# Altium project PCB_Project1.PrjPCB
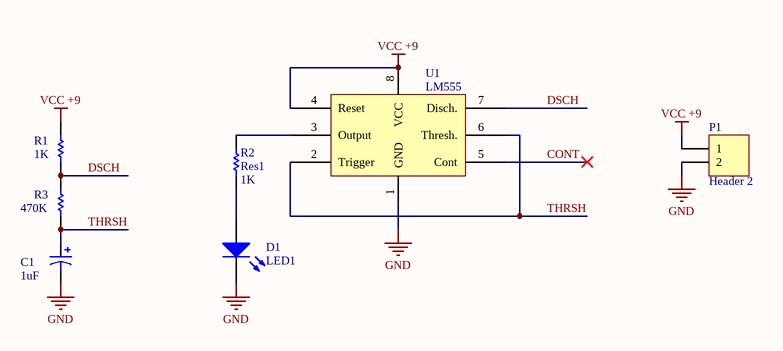
[diagram p0: Sheet1.SchDoc]
1 sheet, 7 parts. Net scope: global (net labels, ports and power ports of the same name join across sheets).

## Sheet Sheet1.SchDoc
size A4

### Parts
C1  value 1uF  [RB7.6-15]  (hidden comment: Cap Pol1)
D1  LED1  [LED-1]
P1  Header 2  [HDR1X2]
R1  value 1K  [AXIAL-0.3]  (hidden comment: Res1)
R2  Res1  value 1K  [AXIAL-0.3]
R3  value 470K  [AXIAL-0.3]  (hidden comment: Res1)
U1  LM555  [LM555DIP]

### Nets
GND: C1.2 D1.2(K) P1.2 U1.1(GND)
VCC +9: P1.1 R1.2 U1.4(Reset) U1.8(VCC)
CONT: U1.5(Cont)
DSCH: R1.1 R3.2 U1.7(Disch.)
THRSH: C1.1 R3.1 U1.2(Trigger) U1.6(Thresh.)
NetD1_1: D1.1(A) R2.1
NetR2_2: R2.2 U1.3(Output)

### Library data of the parts
C1 = Cap Pol1: Polarized Capacitor (Radial); Published: 8-Jun-2000; LatestRevisionDate: 17-Jul-2002; LatestRevisionNote: Re-released for DXP Platform.; PackageReference: RB7.6-15; Publisher: Altium Limited; PackageDescription: Polarized Capacitor (Radial); 2 Leads
D1 = LED1: Typical RED GaAs LED; Published: 8-Jun-2000; LatestRevisionDate: 08-Jul-2005; LatestRevisionNote: Mech Layer 1 removed.; PackageReference: LED-1; Publisher: Altium Limited; PackageDescription: LED; 2 Leads
P1 = Header 2: Header, 2-Pin; LatestRevisionDate: 17-Jul-2002; LatestRevisionNote: Re-released for DXP Platform.; Publisher: Altium Limited
R1-R3 = Res1: Resistor; Published: 8-Jun-2000; LatestRevisionDate: 17-Jul-2002; LatestRevisionNote: Re-released for DXP Platform.; PackageReference: AXIAL-0.3; Publisher: Altium Limited; PackageDescription: Axial Device, Thru-Hole; 2 Leads; 0.3 in Pin Spacing
U1 = LM555: LM555 Timer DIP IC